# Altium project 20K Control Board V1.1.PrjPCB (part 2 of 6)

## Sheet DC SPS.SchDoc
size A2
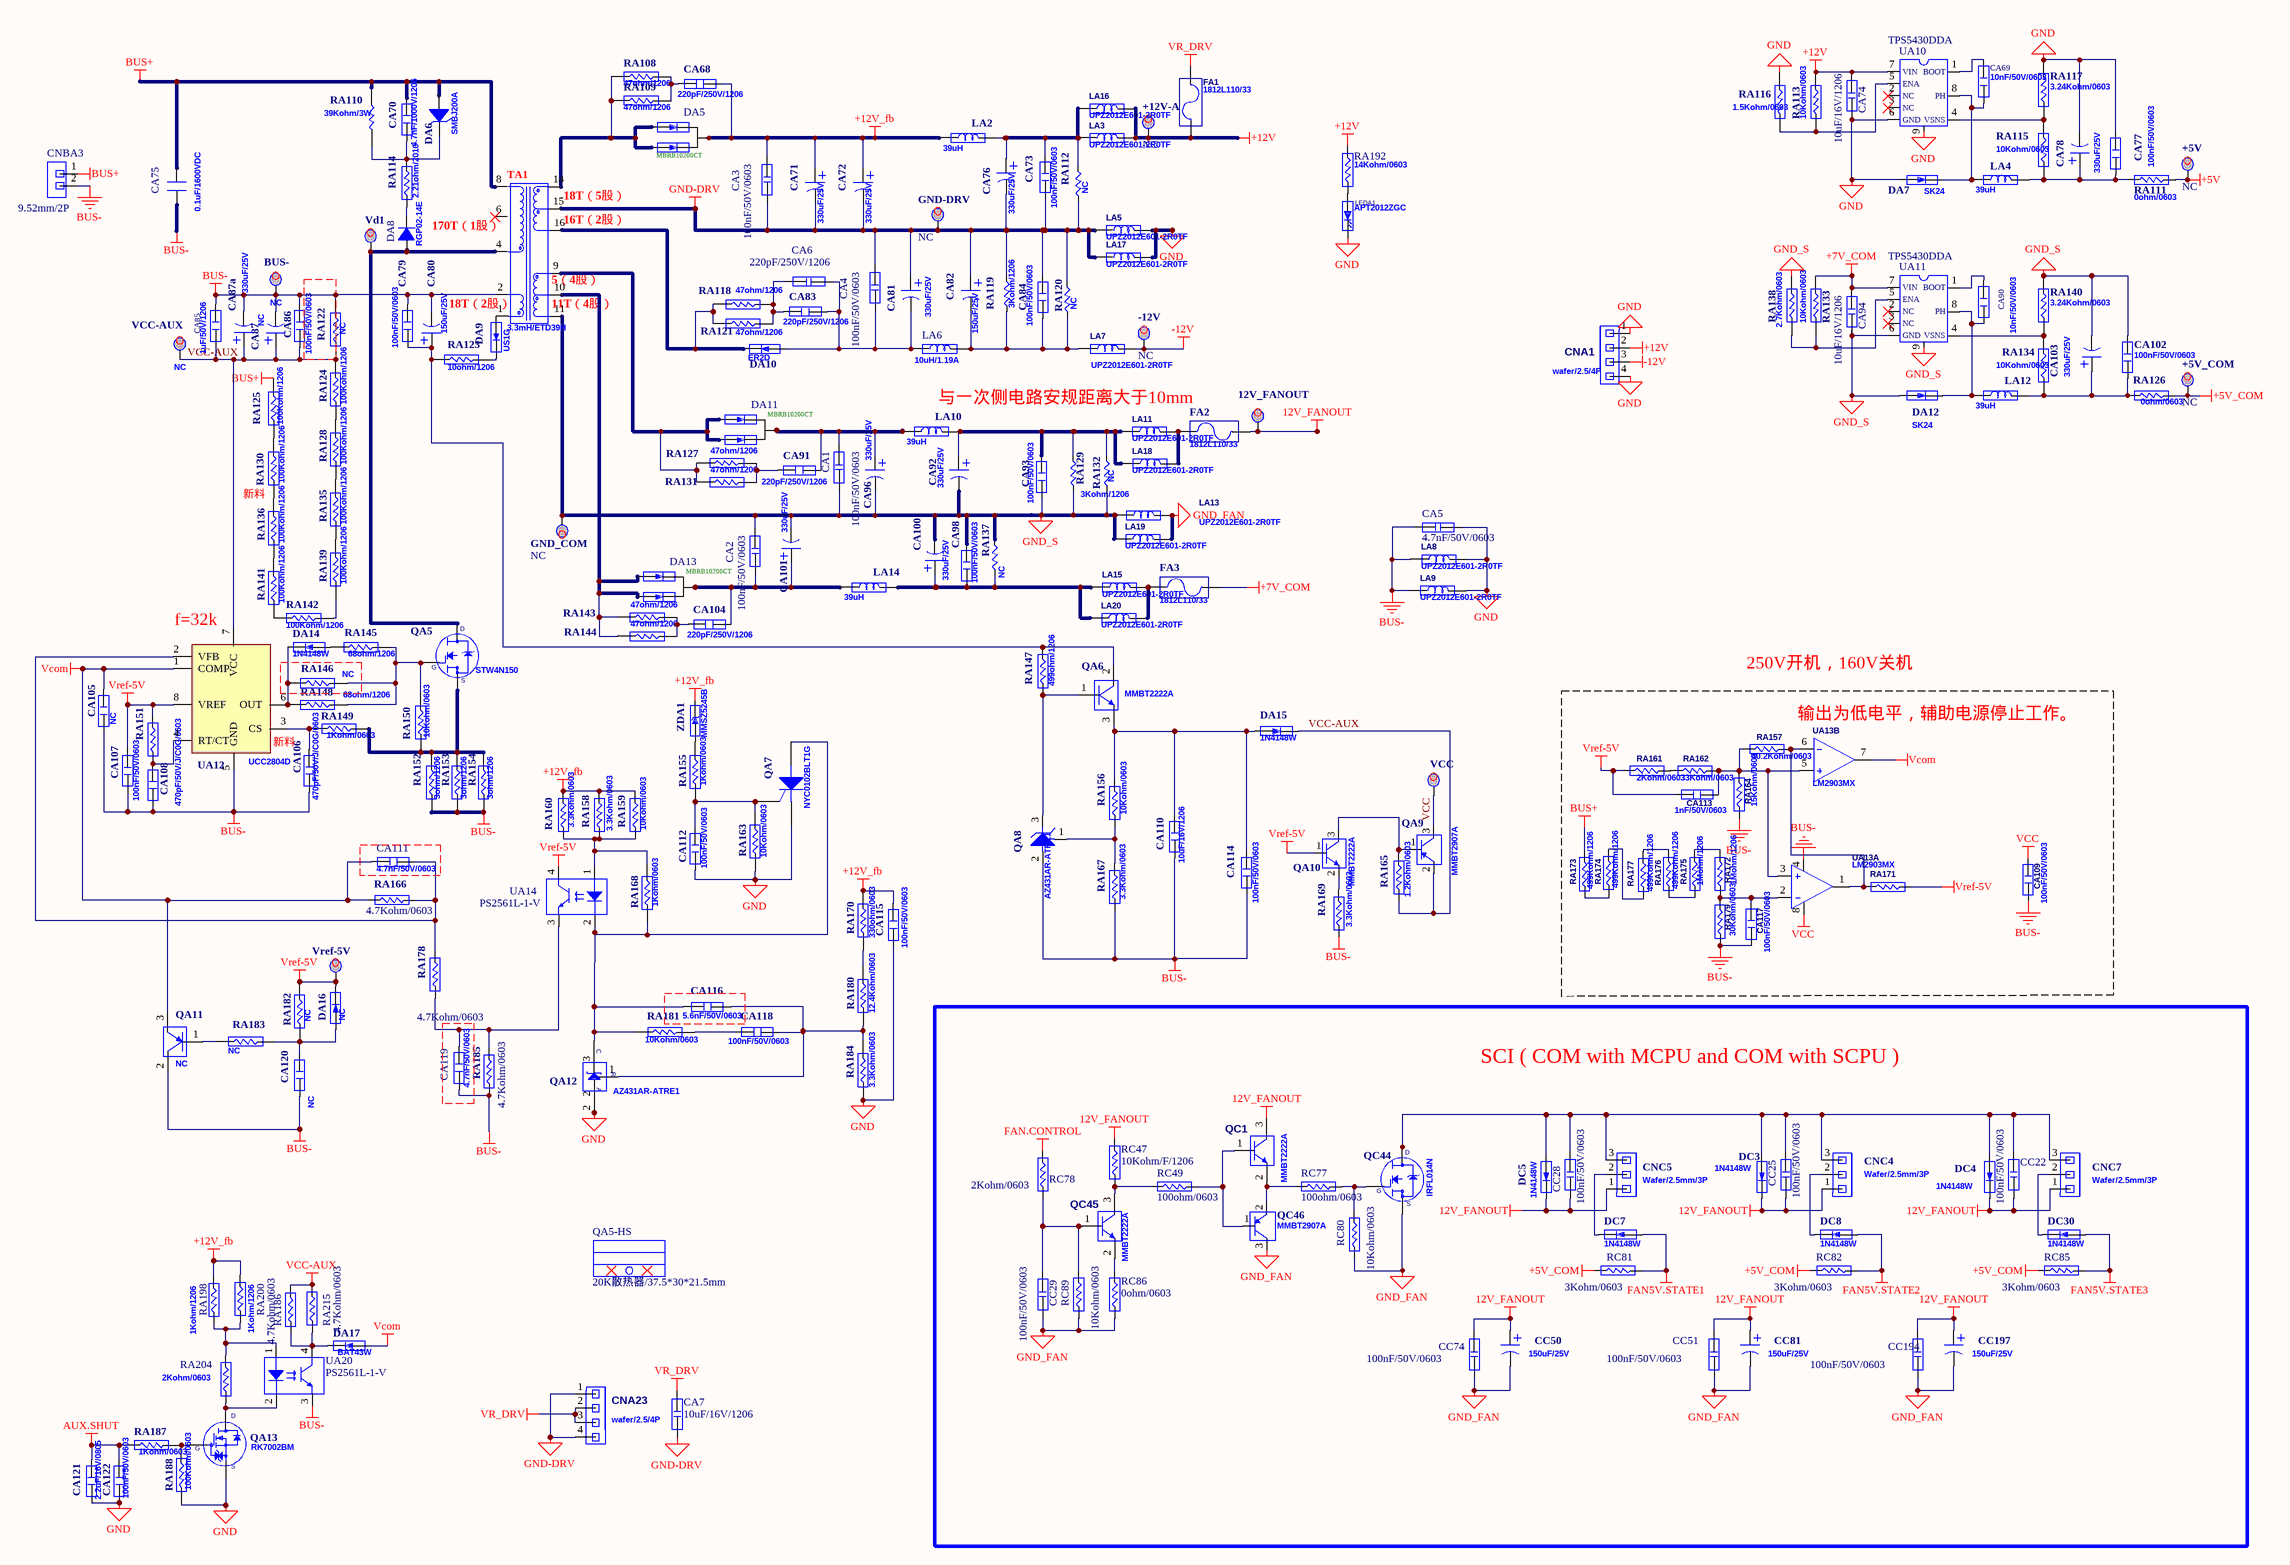
[diagram p2: DC SPS.SchDoc]

### Parts
12V_FANOUT  NC  [TEST-12]  (value not drawn)
+5V  NC  [TEST-12]
+5V_COM  NC  [TEST-12]
+12V-A  NC  [TEST-12]
-12V  NC  [TEST-12]
BUS-  NC  [TEST-12]
CA1  value 100nF/50V/0603  [C0603SM]  (hidden comment: 023-105220-0)
CA2  value 100nF/50V/0603  [C0603SM]  (hidden comment: 023-105220-0)
CA3  value 100nF/50V/0603  [C0603SM]  (hidden comment: 023-105220-0)
CA4  value 100nF/50V/0603  [C0603SM]  (hidden comment: 023-105220-0)
CA5  value 4.7nF/50V/0603  [C0603SM]  (hidden comment: 023-472220-0)
CA6  value 220pF/250V/1206  [C1206SM]  (hidden comment: 023-221250-0)
CA7  value 10uF/16V/1206  [C1206SM]  (hidden comment: 023-106350-0)
CA68  value 220pF/250V/1206  [CC3216-1206]  (hidden comment: 023-221250-0)
CA69  value 10nF/50V/0603  [CC1608-0603]  (hidden comment: 023-103220-0)
CA70  value 4.7nF/1000V/1206  [CC3216-1206]  (hidden comment: 023-472350-0)
CA71  value 330uF/25V  [EC3.5/8.5]  (hidden comment: 020-337100-0)
CA72  value 330uF/25V  [EC3.5/8.5]  (hidden comment: 020-337100-0)
CA73  value 100nF/50V/0603  [CC1608-0603]  (hidden comment: 023-105220-0)
CA74  value 10uF/16V/1206  [C1206SM]  (hidden comment: 023-106350-0)
CA75  value 0.1uF/1600VDC  [PC104/1600V-22.5]  (hidden comment: 022-104001-0)
CA76  value 330uF/25V  [EC3.5/8.5]  (hidden comment: 020-337100-0)
CA77  value 100nF/50V/0603  [CC1608-0603]  (hidden comment: 023-105220-0)
CA78  value 330uF/25V  [EC3.5/8.5]  (hidden comment: 020-337100-0)
CA79  value 100nF/50V/0603  [CC1608-0603]  (hidden comment: 023-105220-0)
CA80  value 150uF/25V  [EC2.54/6.3]  (hidden comment: 020-157111-0)
CA81  value 330uF/25V  [EC3.5/8.5]  (hidden comment: 020-337100-0)
CA82  value 150uF/25V  [EC2.54/6.3]  (hidden comment: 020-157111-0)
CA83  value 220pF/250V/1206  [CC3216-1206]  (hidden comment: 023-221250-0)
CA84  value 100nF/50V/0603  [CC1608-0603]  (hidden comment: 023-105220-0)
CA85  value 1uF/50V/1206  [CC3216-1206]  (hidden comment: 023-105250-0)
CA86  value 100nF/50V/0603  [CC1608-0603]  (hidden comment: 023-105220-0)
CA87  NC  [EC2.54/6.3]
CA87a  value 330uF/25V  [EC3.5/8.5]  (hidden comment: 020-337100-0)
CA90  value 10nF/50V/0603  [CC1608-0603]  (hidden comment: 023-103220-0)
CA91  value 220pF/250V/1206  [CC3216-1206]  (hidden comment: 023-221250-0)
CA92  value 330uF/25V  [EC3.5/8.5]  (hidden comment: 020-337100-0)
CA93  value 100nF/50V/0603  [CC1608-0603]  (hidden comment: 023-105220-0)
CA94  value 10uF/16V/1206  [C1206SM]  (hidden comment: 023-106350-0)
CA96  value 330uF/25V  [EC3.5/8.5]  (hidden comment: 020-337100-0)
CA98  value 100nF/50V/0603  [CC1608-0603]  (hidden comment: 023-105220-0)
CA100  value 330uF/25V  [EC3.5/8.5]  (hidden comment: 020-337100-0)
CA101  value 330uF/25V  [EC3.5/8.5]  (hidden comment: 020-337100-0)
CA102  value 100nF/50V/0603  [CC1608-0603]  (hidden comment: 023-105220-0)
CA103  value 330uF/25V  [EC3.5/8.5]  (hidden comment: 020-337100-0)
CA104  value 220pF/250V/1206  [CC3216-1206]  (hidden comment: 023-221250-0)
CA105  NC  [CC1608-0603]
CA106  value 470pF/50V/J/C0G/0603  [CC1608-0603]  (hidden comment: 023-471220-0)
CA107  value 100nF/50V/0603  [CC1608-0603]  (hidden comment: 023-105220-0)
CA108  value 470pF/50V/J/C0G/0603  [CC1608-0603]  (hidden comment: 023-471220-0)
CA109  value 100nF/50V/0603  [CC1608-0603]  (hidden comment: 023-105220-0)
CA110  value 10uF/16V/1206  [CC3216-1206]  (hidden comment: 023-106350-0)
CA111  value 4.7nF/50V/0603  [CC1608-0603]  (hidden comment: 023-472220-0)
CA112  value 100nF/50V/0603  [CC1608-0603]  (hidden comment: 023-105220-0)
CA113  value 1nF/50V/0603  [CC1608-0603]  (hidden comment: 023-102220-0)
CA114  value 100nF/50V/0603  [CC1608-0603]  (hidden comment: 023-105220-0)
CA115  value 100nF/50V/0603  [CC1608-0603]  (hidden comment: 023-105220-0)
CA116  value 5.6nF/50V/0603  [CC1608-0603]  (hidden comment: 023-562220-0)
CA117  value 100nF/50V/0603  [CC1608-0603]  (hidden comment: 023-105220-0)
CA118  value 100nF/50V/0603  [CC1608-0603]  (hidden comment: 023-105220-0)
CA119  value 4.7nF/50V/0603  [CC1608-0603]  (hidden comment: 023-472220-0)
CA120  NC  [CC1608-0603]
CA121  value 2.2uF/16V/0805  [CC2012-0805]  (hidden comment: 023-225330-0)
CA122  value 100nF/50V/0603  [CC1608-0603]  (hidden comment: 023-105220-0)
CC22  value 100nF/50V/0603  [C0603SM]  (hidden comment: 023-105220-0)
CC25  value 100nF/50V/0603  [C0603SM]  (hidden comment: 023-105220-0)
CC28  value 100nF/50V/0603  [C0603SM]  (hidden comment: 023-105220-0)
CC29  value 100nF/50V/0603  [C0603SM]  (hidden comment: 023-105220-0)
CC50  value 150uF/25V  [EC2.54/6.3]  (hidden comment: 020-157111-0)
CC51  value 100nF/50V/0603  [C0603SM]  (hidden comment: 023-105220-0)
CC74  value 100nF/50V/0603  [C0603SM]  (hidden comment: 023-105220-0)
CC81  value 150uF/25V  [EC2.54/6.3]  (hidden comment: 020-157111-0)
CC194  value 100nF/50V/0603  [C0603SM]  (hidden comment: 023-105220-0)
CC197  value 150uF/25V  [EC2.54/6.3]  (hidden comment: 020-157111-0)
CNA1  value wafer/2.5/4P  [CN2.5-4P]  (hidden comment: 110-252000-0)
CNA23  value wafer/2.5/4P  [CN2.5-4P]  (hidden comment: 110-252000-0)
CNBA3  value 9.52mm/2P  [CN2P9.52]  (hidden comment: 110-309501-0)
CNC4  value Wafer/2.5mm/3P  [CN2.5-3P]  (hidden comment: 110-251000-0)
CNC5  value Wafer/2.5mm/3P  [CN2.5-3P]  (hidden comment: 110-251000-0)
CNC7  value Wafer/2.5mm/3P  [CN2.5-3P]  (hidden comment: 110-251000-0)
DA5  value MBRB10200CT  [D2PAK - 1]  (hidden comment: 060-310030-0)
DA6  value SMBJ200A  [TVS-SMB]  (hidden comment: 083-100010-0)
DA7  value SK24  [DO-SMB]  (hidden comment: 060-310020-0)
DA8  value RGP02-14E  [DO-5.08/2.5]  (hidden comment: 060-100000-0)
DA9  value US1G  [DO-SMA]  (hidden comment: 060-110010-0)
DA10  value ER2D  [DO-SMA]  (hidden comment: 060-110000-0)
DA11  value MBRB10200CT  [D2PAK - 1]  (hidden comment: 060-310030-0)
DA12  value SK24  [DO-SMB]  (hidden comment: 060-310020-0)
DA13  value MBRB10200CT  [D2PAK - 1]  (hidden comment: 060-310030-0)
DA14  value 1N4148W  [SOD-123]  (hidden comment: 060-500010-0)
DA15  value 1N4148W  [SOD-123]  (hidden comment: 060-500010-0)
DA16  NC  [SOD-123]
DA17  value BAT43W  [SOD-123]  (hidden comment: 060-310000-0)
DC3  value 1N4148W  [SOD-123]  (hidden comment: 060-500010-0)
DC4  value 1N4148W  [SOD-123]  (hidden comment: 060-500010-0)
DC5  value 1N4148W  [SOD-123]  (hidden comment: 060-500010-0)
DC7  value 1N4148W  [SOD-123]  (hidden comment: 060-500010-0)
DC8  value 1N4148W  [SOD-123]  (hidden comment: 060-500010-0)
DC30  value 1N4148W  [SOD-123]  (hidden comment: 060-500010-0)
FA1  value 1812L110/33  [17KFUSE1812L110-33]  (hidden comment: 160-201000-0)
FA2  value 1812L110/33  [17KFUSE1812L110-33]  (hidden comment: 160-201000-0)
FA3  value 1812L110/33  [17KFUSE1812L110-33]  (hidden comment: 160-201000-0)
GND-DRV  NC  [TEST-12]
GND_COM  NC  [TEST-12]
LA2  value 39uH  [L1110SM- 39UH]  (hidden comment: 040-390000-0)
LA3  value UPZ2012E601-2R0TF  [L2012-0805]  (hidden comment: 080-200000-0)
LA4  value 39uH  [L1110SM- 39UH]  (hidden comment: 040-390000-0)
LA5  value UPZ2012E601-2R0TF  [L2012-0805]  (hidden comment: 080-200000-0)
LA6  value 10uH/1.19A  [L4848SM]  (hidden comment: 040-109100-0)
LA7  value UPZ2012E601-2R0TF  [L2012-0805]  (hidden comment: 080-200000-0)
LA8  value UPZ2012E601-2R0TF  [L2012-0805]  (hidden comment: 080-200000-0)
LA9  value UPZ2012E601-2R0TF  [L2012-0805]  (hidden comment: 080-200000-0)
LA10  value 39uH  [L1110SM- 39UH]  (hidden comment: 040-390000-0)
LA11  value UPZ2012E601-2R0TF  [L2012-0805]  (hidden comment: 080-200000-0)
LA12  value 39uH  [L1110SM- 39UH]  (hidden comment: 040-390000-0)
LA13  value UPZ2012E601-2R0TF  [L2012-0805]  (hidden comment: 080-200000-0)
LA14  value 39uH  [L1110SM- 39UH]  (hidden comment: 040-390000-0)
LA15  value UPZ2012E601-2R0TF  [L2012-0805]  (hidden comment: 080-200000-0)
LA16  value UPZ2012E601-2R0TF  [L2012-0805]  (hidden comment: 080-200000-0)
LA17  value UPZ2012E601-2R0TF  [L2012-0805]  (hidden comment: 080-200000-0)
LA18  value UPZ2012E601-2R0TF  [L2012-0805]  (hidden comment: 080-200000-0)
LA19  value UPZ2012E601-2R0TF  [L2012-0805]  (hidden comment: 080-200000-0)
LA20  value UPZ2012E601-2R0TF  [L2012-0805]  (hidden comment: 080-200000-0)
LEDA1  value APT2012ZGC  [LED2012-0805SM]  (hidden comment: 060-011000-0)
QA5  value STW4N150  [TO-247]  (hidden comment: 063-000010-0)
QA5-HS  value 20K散热器/37.5*30*21.5mm  [HS30x10x37.5]  (hidden comment: 431-100000-0)
QA6  value MMBT2222A  [SOT-23]  (hidden comment: 061-010000-0)
QA7  value NYC0102BLT1G  [SOT-23]  (hidden comment: 062-000010-0)
QA8  value AZ431AR-ATRE1  [SOT89N]  (hidden comment: 050-210020-0)
QA9  value MMBT2907A  [SOT-23]  (hidden comment: 061-110000-0)
QA10  value MMBT2222A  [SOT-23]  (hidden comment: 061-010000-0)
QA11  NC  [SOT-23]
QA12  value AZ431AR-ATRE1  [SOT89N]  (hidden comment: 050-210020-0)
QA13  value RK7002BM  [SOT-23 - 1]  (hidden comment: 063-010010-0)
QC1  value MMBT2222A  [SOT-23]  (hidden comment: 061-010000-0)
QC44  value IRFL014N  [SOT223]  (hidden comment: 063-010000-0)
QC45  value MMBT2222A  [SOT-23]  (hidden comment: 061-010000-0)
QC46  value MMBT2907A  [SOT-23]  (hidden comment: 061-110000-0)
RA108  value 47ohm/1206  [R3216-1206]  (hidden comment: 011-470050-0)
RA109  value 47ohm/1206  [R3216-1206]  (hidden comment: 011-470050-0)
RA110  value 39Kohm/3W  [R3WA-5.0-S]  (hidden comment: 013-390240-0)
RA111  value 0ohm/0603  [R1608-0603]  (hidden comment: 011-000020-0)
RA112  NC  [R3216-1206]
RA113  value 10Kohm/0603  [R1608-0603]  (hidden comment: 011-103020-0)
RA114  value 2.21ohm/2010  [R5025-2010]  (hidden comment: 011-227070-0)
RA115  value 10Kohm/0603  [R1608-0603]  (hidden comment: 011-103020-0)
RA116  value 1.5Kohm/0603  [R1608-0603]  (hidden comment: 011-152020-0)
RA117  value 3.24Kohm/0603  [R1608-0603]  (hidden comment: 011-322020-0)
RA118  value 47ohm/1206  [R3216-1206]  (hidden comment: 011-470050-0)
RA119  value 3Kohm/1206  [R3216-1206]  (hidden comment: 011-302050-0)
RA120  NC  [R3216-1206]
RA121  value 47ohm/1206  [R3216-1206]  (hidden comment: 011-470050-0)
RA122  NC  [R1608-0603]
RA123  value 10ohm/1206  [R3216-1206]  (hidden comment: 011-100050-0)
RA124  value 100Kohm/1206  [R3216-1206]  (hidden comment: 011-104050-0)
RA125  value 100Kohm/1206  [R3216-1206]  (hidden comment: 011-104050-0)
RA126  value 0ohm/0603  [R1608-0603]  (hidden comment: 011-000020-0)
RA127  value 47ohm/1206  [R3216-1206]  (hidden comment: 011-470050-0)
RA128  value 100Kohm/1206  [R3216-1206]  (hidden comment: 011-104050-0)
RA129  value 3Kohm/1206  [R3216-1206]  (hidden comment: 011-302050-0)
RA130  value 100Kohm/1206  [R3216-1206]  (hidden comment: 011-104050-0)
RA131  value 47ohm/1206  [R3216-1206]  (hidden comment: 011-470050-0)
RA132  NC  [R3216-1206]
RA133  value 10Kohm/0603  [R1608-0603]  (hidden comment: 011-103020-0)
RA134  value 10Kohm/0603  [R1608-0603]  (hidden comment: 011-103020-0)
RA135  value 100Kohm/1206  [R3216-1206]  (hidden comment: 011-104050-0)
RA136  value 100Kohm/1206  [R3216-1206]  (hidden comment: 011-104050-0)
RA137  NC  [R3216-1206]
RA138  value 2.7Kohm/0603  [R1608-0603]  (hidden comment: 011-272020-0)
RA139  value 100Kohm/1206  [R3216-1206]  (hidden comment: 011-104050-0)
RA140  value 3.24Kohm/0603  [R1608-0603]  (hidden comment: 011-322020-0)
RA141  value 100Kohm/1206  [R3216-1206]  (hidden comment: 011-104050-0)
RA142  value 100Kohm/1206  [R3216-1206]  (hidden comment: 011-104050-0)
RA143  value 47ohm/1206  [R3216-1206]  (hidden comment: 011-470050-0)
RA144  value 47ohm/1206  [R3216-1206]  (hidden comment: 011-470050-0)
RA145  value 68ohm/1206  [R3216-1206]  (hidden comment: 011-680050-0)
RA146  NC  [R3216-1206]
RA147  value 499ohm/1206  [R3216-1206]  (hidden comment: 011-491050-0)
RA148  value 68ohm/1206  [R3216-1206]  (hidden comment: 011-680050-0)
RA149  value 1Kohm/0603  [R1608-0603]  (hidden comment: 011-102020-0)
RA150  value 10Kohm/0603  [R1608-0603]  (hidden comment: 011-103020-0)
RA151  011-493020-0  [R1608-0603]  (value not drawn)
RA152  value 3ohm/1206  [R3216-1206]  (hidden comment: 011-307050-0)
RA153  value 3ohm/1206  [R3216-1206]  (hidden comment: 011-307050-0)
RA154  value 3ohm/1206  [R3216-1206]  (hidden comment: 011-307050-0)
RA155  value 1Kohm/0603  [R1608-0603]  (hidden comment: 011-102020-0)
RA156  value 10Kohm/0603  [R1608-0603]  (hidden comment: 011-103020-0)
RA157  value 40.2Kohm/0603  [R1608-0603]  (hidden comment: 011-403020-0)
RA158  value 3.3Kohm/0603  [R1608-0603]  (hidden comment: 011-332020-0)
RA159  value 10Kohm/0603  [R1608-0603]  (hidden comment: 011-103020-0)
RA160  value 3.3Kohm/0603  [R1608-0603]  (hidden comment: 011-332020-0)
RA161  value 2Kohm/0603  [R1608-0603]  (hidden comment: 011-202020-0)
RA162  value 33Kohm/0603  [R1608-0603]  (hidden comment: 011-333020-0)
RA163  value 10Kohm/0603  [R1608-0603]  (hidden comment: 011-103020-0)
RA164  value 15Kohm/0603  [R1608-0603]  (hidden comment: 011-153020-0)
RA165  value 1.2Kohm/0603  [R1608-0603]  (hidden comment: 011-122020-0)
RA166  value 4.7Kohm/0603  [R1608-0603]  (hidden comment: 011-472020-0)
RA167  value 3.3Kohm/0603  [R1608-0603]  (hidden comment: 011-332020-0)
RA168  value 1Kohm/0603  [R1608-0603]  (hidden comment: 011-102020-0)
RA169  value 3.3Kohm/0603  [R1608-0603]  (hidden comment: 011-332020-0)
RA170  value 330ohm/0603  [R1608-0603]  (hidden comment: 011-331020-0)
RA171  011-493020-0  [R1608-0603]  (value not drawn)
RA172  value 1Mohm/1206  [R3216-1206]  (hidden comment: 011-106050-0)
RA173  value 499Kohm/1206  [R3216-1206]  (hidden comment: 011-494050-0)
RA174  value 499Kohm/1206  [R3216-1206]  (hidden comment: 011-494050-0)
RA175  value 1Mohm/1206  [R3216-1206]  (hidden comment: 011-106050-0)
RA176  value 499Kohm/1206  [R3216-1206]  (hidden comment: 011-494050-0)
RA177  value 499Kohm/1206  [R3216-1206]  (hidden comment: 011-494050-0)
RA178  value 4.7Kohm/0603  [R1608-0603]  (hidden comment: 011-472020-0)
RA179  value 30Kohm/0603  [R1608-0603]  (hidden comment: 011-303020-0)
RA180  value 12.4Kohm/0603  [R1608-0603]  (hidden comment: 011-123020-0)
RA181  value 10Kohm/0603  [R1608-0603]  (hidden comment: 011-103020-0)
RA182  NC  [R1608-0603]
RA183  NC  [R1608-0603]
RA184  value 3.3Kohm/0603  [R1608-0603]  (hidden comment: 011-332020-0)
RA185  value 4.7Kohm/0603  [R1608-0603]  (hidden comment: 011-472020-0)
RA186  value 4.7Kohm/0603  [R1608-0603]  (hidden comment: 011-472020-0)
RA187  value 1Kohm/0603  [R1608-0603]  (hidden comment: 011-102020-0)
RA188  value 100Kohm/0603  [R1608-0603]  (hidden comment: 011-104020-0)
RA192  value 14Kohm/0603  [R1608-0603]  (hidden comment: 011-143020-0)
RA198  value 1Kohm/1206  [R3216-1206]  (hidden comment: 011-102050-0)
RA200  value 1Kohm/1206  [R3216-1206]  (hidden comment: 011-102050-0)
RA204  value 2Kohm/0603  [R1608-0603]  (hidden comment: 011-202020-0)
RA215  value 4.7Kohm/0603  [R1608-0603]  (hidden comment: 011-472020-0)
RC47  value 10Kohm/F/1206  [R1206SM]  (hidden comment: 011-103050-0)
RC49  value 100ohm/0603  [R0603SM]  (hidden comment: 011-101020-0)
RC77  value 100ohm/0603  [R0603SM]  (hidden comment: 011-101020-0)
RC78  value 2Kohm/0603  [R0603SM]  (hidden comment: 011-202020-0)
RC80  value 10Kohm/0603  [R0603SM]  (hidden comment: 011-103020-0)
RC81  value 3Kohm/0603  [R0603SM]  (hidden comment: 011-302020-0)
RC82  value 3Kohm/0603  [R0603SM]  (hidden comment: 011-302020-0)
RC85  value 3Kohm/0603  [R0603SM]  (hidden comment: 011-302020-0)
RC86  value 0ohm/0603  [R0603SM]  (hidden comment: 011-000020-0)
RC89  value 10Kohm/0603  [R0603SM]  (hidden comment: 011-103020-0)
TA1  value 3.3mH/ETD39H  [EC39(8+8P)-1]  (hidden comment: 030-001000-0)
UA10  value TPS5430DDA  [SO8-5X4-PD]  (hidden comment: 050-210030-0)
UA11  value TPS5430DDA  [SO8-5X4-PD]  (hidden comment: 050-210030-0)
UA12  value UCC2804D  [SO8]  (hidden comment: 050-410010-0)
UA13  value LM2903MX  [SO8]  (hidden comment: 050-610040-0)  (parts A,B of 2)
UA14  value PS2561L-1-V  [LTV816SB-V]  (hidden comment: 050-010000-0)
UA20  value PS2561L-1-V  [LTV816SB-V]  (hidden comment: 050-010000-0)
VCC  NC  [TEST-12]  (value not drawn)
VCC-AUX  NC  [TEST-12]
Vd1  NC  [TEST-12]  (value not drawn)
Vref-5V  NC  [TEST-12]  (value not drawn)
ZDA1  value MMSZ5245B  [SOD-123]  (hidden comment: 060-210010-0)

### Blocks framed on the sheet
输出为低电平，辅助电源停止工作。: CA109 CA113 CA117 RA157 RA161 RA162 RA164 RA171-RA177 RA179 UA13
SCI ( COM with MCPU and COM with SCPU ): CC22 CC25 CC28 CC29 CC50 CC51 CC74 CC81 CC194 CC197 CNC4 CNC5 CNC7 DC3-DC5 DC7 DC8 DC30 QC1 QC44-QC46 RC47 RC49 RC77 RC78 RC80-RC82 RC85 RC86 RC89

### Nets
12V_FANOUT: 12V_FANOUT.1 CC22.1 CC25.1 CC28.1 CC50.1 CC51.2 CC74.2 CC81.1 CC194.2 CC197.1 CNC4.1 CNC5.1 CNC7.1 DC3.2 DC4.2 DC5.2 FA2.1 QC1.3 RC47.2
+5V: +5V.1 RA111.1
+5V_COM: +5V_COM.1 RA126.1 RC81.1 RC82.1 RC85.1
+7V_COM: CA94.2 FA3.1 RA133.1 UA11.7(VIN)
+12V: +12V-A.1 CA74.2 CNA1.2 FA1.2 LA3.2 LA16.2 RA113.1 RA192.2 UA10.7(VIN)
+12V_fb: CA3.2 CA68.2 CA71.1 CA72.1 CA115.2 DA5.2 DA5.4 LA2.1 RA158.2 RA159.2 RA160.2 RA170.2 RA198.2 RA200.2 ZDA1.2
-12V: -12V.1 CNA1.3 LA7.2
AUX.SHUT: CA121.2 CA122.2 RA187.1
BUS+: CA70.2 CA75.2 CNBA3.1 DA6.1(A) RA110.2 RA125.1 RA173.2 TA1.8
BUS-: BUS-.1 CA5.1 CA75.1 CA79.2 CA80.2 CA85.2 CA86.2 CA87.2 CA87a.2 CA105.1 CA106.1 CA107.2 CA108.1 CA109.1 CA110.1 CA114.1 CA117.1 CA119.1 CA120.1 CNBA3.2 LA8.1 LA9.1 QA8.2(A) QA11.2 RA122.2 RA152.1 RA153.1 RA154.1 RA164.1 RA167.1 RA169.1 RA179.1 RA185.1 TA1.2 UA12.5(GND) UA13.4(-) UA20.3
FAN5V.STATE1: DC7.1 RC81.2
FAN5V.STATE2: DC8.1 RC82.2
FAN5V.STATE3: DC30.1 RC85.2
FAN.CONTROL: RC78.2
GND: CA5.2 CA74.1 CA77.1 CA78.2 CA112.1 CA115.1 CA121.1 CA122.1 CNA1.1 CNA1.4 DA7.1 LA5.2 LA8.2 LA9.2 LA17.2 LEDA1.2 QA7.1(K) QA12.2 QA13.1 RA116.2 RA117.1 RA163.1 RA184.1 RA188.1 UA10.6(GND) UA10.9(GND)
GND-DRV: CA3.1 CA4.2 CA7.1 CA71.2 CA72.2 CA73.1 CA76.2 CA81.1 CA82.1 CA84.2 CNA23.1 CNA23.4 GND-DRV.1 LA5.1 LA17.1 RA112.2 RA119.1 RA120.1 TA1.15
GND_FAN: CC29.1 CC50.2 CC51.1 CC74.1 CC81.2 CC194.1 CC197.2 LA13.2 LA19.2 QC44.3 QC46.3 RC80.1 RC86.1 RC89.1
GND_S: CA1.1 CA2.2 CA92.2 CA93.1 CA94.1 CA96.2 CA98.2 CA100.2 CA101.2 CA102.1 CA103.2 DA12.1 GND_COM.1 LA13.1 LA19.1 RA129.2 RA132.2 RA137.1 RA138.1 RA140.1 TA1.11 UA11.6(GND) UA11.9(GND)
VCC: CA109.2 QA9.3 UA13.8(+) VCC.1
VCC-AUX: CA85.1 CA86.1 CA87.1 CA87a.1 DA15.2 QA9.2 RA122.1 RA124.1 RA165.1 RA186.2 RA215.2 UA12.7(VCC) VCC-AUX.1
Vcom: CA105.2 CA111.2 DA17.1(A) QA11.3 RA166.1 UA12.1(COMP) UA13.7
VR_DRV: CA7.2 CNA23.2 CNA23.3 FA1.1
Vref-5V: CA107.1 CA113.1 DA16.2 QA10.1 RA151.1 RA161.2 RA171.2 RA182.2 UA12.8(VREF) UA14.4 Vref-5V.1
NetCA1_2: CA1.2 CA91.2 CA96.1 DA11.2 DA11.4 LA10.1
NetCA2_1: CA2.1 CA101.1 CA104.2 DA13.2 DA13.4 LA14.1
NetCA4_1: CA4.1 CA6.2 CA81.2 CA83.2 DA10.1 LA6.1
NetCA6_1: CA6.1 CA83.1 RA118.2 RA121.2
NetCA68_1: CA68.1 RA108.2 RA109.2
NetCA69_1: CA69.1 UA10.1(BOOT)
NetCA69_2: CA69.2 DA7.2 LA4.1 UA10.8(PH)
NetCA70_1: CA70.1 DA6.2(K) RA110.1 RA114.1
NetCA73_2: CA73.2 CA76.1 LA2.2 LA3.1 LA16.1 RA112.1
NetCA77_2: CA77.2 CA78.1 LA4.2 RA111.2 RA115.2
NetCA79_1: CA79.1 CA80.1 QA6.2 RA123.2 RA147.2
NetCA82_2: CA82.2 CA84.1 LA6.2 LA7.1 RA119.2 RA120.2
NetCA90_1: CA90.1 UA11.1(BOOT)
NetCA90_2: CA90.2 DA12.2 LA12.1 UA11.8(PH)
NetCA91_1: CA91.1 RA127.2 RA131.2
NetCA92_1: CA92.1 CA93.2 LA10.2 LA11.1 LA18.1 RA129.1 RA132.1
NetCA98_1: CA98.1 CA100.1 LA14.2 LA15.1 LA20.1 RA137.2
NetCA102_2: CA102.2 CA103.1 LA12.2 RA126.2 RA134.2
NetCA104_1: CA104.1 RA143.2 RA144.2
NetCA106_2: CA106.2 RA149.2 UA12.3(CS)
NetCA108_2: CA108.2 RA151.2 UA12.4(RT/CT)
NetCA110_2: CA110.2 CA114.2 DA15.1 QA6.3 RA156.2
NetCA111_1: CA111.1 RA166.2 RA178.2 UA12.2(VFB)
NetCA112_2: CA112.2 QA7.2(G) RA155.1 RA163.2
NetCA113_2: CA113.2 RA157.1 RA162.1 RA164.2 UA13.3 UA13.5
NetCA116_1: CA116.1 CA118.1 QA12.1 RA180.1 RA184.2
NetCA116_2: CA116.2 QA7.3(A) QA12.3 RA168.1 RA181.2 UA14.2
NetCA117_2: CA117.2 RA172.2 RA179.2 UA13.2
NetCA118_2: CA118.2 RA181.1
NetCA119_2: CA119.2 RA178.1 RA185.2 UA14.3
NetCA120_2: CA120.2 DA16.1 RA182.1 RA183.1
NetCC22_2: CC22.2 CC25.2 CC28.2 CNC4.3 CNC5.3 CNC7.3 DC3.1 DC4.1 DC5.1 QC44.2 QC44.4
NetCC29_2: CC29.2 QC45.1 RC78.1 RC89.2
NetCNC4_2: CNC4.2 DC8.2
NetCNC5_2: CNC5.2 DC7.2
NetCNC7_2: CNC7.2 DC30.2
NetDA5_1: DA5.1 DA5.3 RA108.1 RA109.1 TA1.14
NetDA8_1: DA8.1 QA5.2 TA1.4 Vd1.1
NetDA8_2: DA8.2 RA114.2
NetDA9_1: DA9.1(A) TA1.1
NetDA9_2: DA9.2(K) RA123.1
NetDA10_2: DA10.2 RA118.1 RA121.1 TA1.16
NetDA11_1: DA11.1 DA11.3 RA127.1 RA131.1 TA1.9
NetDA13_1: DA13.1 DA13.3 RA143.1 RA144.1 TA1.10
NetDA14_1: DA14.1 RA145.1
NetDA14_2: DA14.2 RA146.1 RA148.1 UA12.6(OUT)
NetDA17_2: DA17.2(K) RA186.1 RA215.1 UA20.4
NetFA2_2: FA2.2 LA11.2 LA18.2
NetFA3_2: FA3.2 LA15.2 LA20.2
NetLEDA1_1: LEDA1.1 RA192.1
NetQA5_1: QA5.1 RA145.2 RA146.2 RA148.2 RA150.1
NetQA5_3: QA5.3 RA149.1 RA150.2 RA152.2 RA153.2 RA154.2
NetQA6_1: QA6.1 QA8.3(K) RA147.1
NetQA8_1: QA8.1(R) RA156.1 RA167.2
NetQA9_1: QA9.1 QA10.3 RA165.2
NetQA10_2: QA10.2 RA169.2
NetQA11_1: QA11.1 RA183.2
NetQA13_2: QA13.2 RA187.2 RA188.2
NetQA13_3: QA13.3 RA204.1 UA20.2
NetQC1_1: QC1.1 QC46.1 RC49.2
NetQC1_2: QC1.2 QC46.2 RC77.1
NetQC44_1: QC44.1 RC77.2 RC80.2
NetQC45_2: QC45.2 RC86.2
NetQC45_3: QC45.3 RC47.1 RC49.1
NetRA113_2: RA113.2 RA116.1 UA10.5(ENA)
NetRA115_1: RA115.1 RA117.2 UA10.4(VSENSE)
NetRA124_2: RA124.2 RA128.1
NetRA125_2: RA125.2 RA130.1
NetRA128_2: RA128.2 RA135.1
NetRA130_2: RA130.2 RA136.1
NetRA133_2: RA133.2 RA138.2 UA11.5(ENA)
NetRA134_1: RA134.1 RA140.2 UA11.4(VSENSE)
NetRA135_2: RA135.2 RA139.1
NetRA136_2: RA136.2 RA141.1
NetRA139_2: RA139.2 RA142.2
NetRA141_2: RA141.2 RA142.1
NetRA155_2: RA155.2 ZDA1.1
NetRA157_2: RA157.2 RA171.1 UA13.1 UA13.6
NetRA158_1: RA158.1 RA159.1 RA160.1 RA168.2 UA14.1
NetRA161_1: RA161.1 RA162.2
NetRA170_1: RA170.1 RA180.2
NetRA172_1: RA172.1 RA175.2
NetRA173_1: RA173.1 RA174.1
NetRA174_2: RA174.2 RA177.1
NetRA175_1: RA175.1 RA176.1
NetRA176_2: RA176.2 RA177.2
NetRA198_1: RA198.1 RA200.1 RA204.2 UA20.1

Not connected (* = marked no-connect by the designer): QA5-HS 1* 2*; TA1 6*; UA10 2(NC)* 3(NC)*; UA11 2(NC)* 3(NC)*

### Notes on the sheet
- 170T（1股）
- (near TA1) 18T（5股）
- (near TA1) 16T（2股）
- 18T（2股）
- (near TA1) 5（4股）
- (near TA1) 11T（4股）
- (near LA10) 与一次侧电路安规距离大于10mm
- 新料
- (near UA12) f=32k
- 250V开机，160V关机
- (near UA12) 新料
- (in symbol 17KIRF740) D; G; S
- (in symbol 17KIRFL014NTRPBF) D; G; S
- (in symbol 050-210030-0 SO8-5X4-PD) VSNS
- (in symbol IC 431SM) C; R; A
- (in symbol MOS RK7002SM) D; G; S

### Library data of the parts
12V_FANOUT +5V +5V_COM +12V-A -12V BUS- GND-DRV GND_COM VCC VCC-AUX Vref-5V = 17K TPD: Type: 插件; Value: NC
  12V_FANOUT +5V_COM +12V-A -12V BUS- GND-DRV GND_COM VCC VCC-AUX Vref-5V: User Parameter 1: NC
CA1-CA4 CC22 CC25 CC28 CC29 CC51 CC74 CC194 = 023-104320-0 C0603SM: 100nF/50V/J/X7R/0603; Name of Material: 陶瓷电容; Vendor: 三星/YAGEO; Assembly type: 贴片; PN: 023-104320-0
CA5 = 023-472220-0 C0603SM: 4.7nF/50V/J/X7R/0603; Name of Material: 陶瓷电容; Vendor: 三星/YAGEO; Assembly type: 贴片; PN: 023-472220-0
CA6 = 023-221250-0 C1206SM: 220pF/250V/J/C0G/1206; Name of Material: 陶瓷电容; Vendor: 三星/YAGEO; Assembly type: 贴片; PN: 023-221250-0
CA7 CA74 CA94 = 023-106350-0 C1206SM: 10uF/16V/K/X7R/1206; Name of Material: 陶瓷电容; Vendor: 三星/YAGEO; Assembly type: 贴片; PN: 023-106350-0
CA68 CA83 CA91 CA104 = C1206 SM: 220pF/250V/J/C0G/1206
CA69 CA90 = CC0603-103SM_J: 10nF/50V/J/X7R/0603; Part Type: SMD
CA70 = 17KC472/1KV: 4.7nF/1000V/K/X7R/1206
CA71 CA72 CA76 CA78 CA81 CA87a CA92 CA96 CA100 CA101 CA103 = C220UF/25V: 330uF/25V/Φ8*15/4000H/EKY
CA73 CA77 CA79 CA84 CA86 CA93 CA98 CA102 CA107 CA112 CA114 CA115 CA118 CA122 = C0603 SM: 100nF/50V/J/X7R/0603
CA75 = PC0.1uF/1600V: 0.1uF/1600VDC/±10%/P22.5/12*22*26.5; Vendor: WIMA; Part Type: THD
CA80 CA82 CC50 CC81 CC197 = C100UF插件: 150uF/25V/P2.5/Φ6.3*11/6000H
CA85 = C1206 SM: 1uF/50V/K/X7R/1206
CA87 = C100UF插件: PN: 020-157110-0; Value: NC
CA105 = C0603 SM: value: NC
CA106 = C0603 SM: 470pF/50V/J/C0G/0603
CA108 = CC0603-471SM: 470pF/50V/J/C0G/0603; Part Type: SMD
CA109 CA117 = CC0603-104SM_J: 100nF/50V/J/X7R/0603; Part Type: SMD
CA110 = CC1206-106/16VSM: 10uF/16V/K/X7R/1206; Part Type: SMD
CA111 CA119 = CC0603-103SM: 4.7nF/50V/J/X7R/0603; Part Type: SMD
CA113 = CC0603-102SM: 1nF/50V/J/C0G/0603; Part Type: SMD
CA116 = C0603 SM: 5.6nF/50V/K/0603
CA120 = C0603 SM: PN: 023-104320-0; value: NC
CA121 = CC0805-225/16VSM: 2.2uF/16V/K/X7R/0805; Part Type: SMD
CNA1 CNA23 = CN 25P04: Wafer/2.5 pitch/4 pin/182度/白胶/带卡勾; Part Type: THD
CNBA3 = 110-309500-0 CN2P9.52: 接线端子台/9.52mm/2P; Name of Material: 接线端子; Factory model: EK950V-02P; Assembly type: 贴片; PN: 110-309501-0
CNC4 CNC5 CNC7 = CN 25P03: Wafer/2.5 pitch/3 pin/181度/白胶/带卡勾
DA5 DA11 DA13 = D MBRB10200CT: 10A/200V/D(2)PAK; Vendor: MCC; Part Type: SMD
DA6 = 17KP6SMBJ170: 200V/600W/DO-214AA; Type: 贴片
DA7 DA12 = D SK24: 2A/40V/DO-214AA
DA8 = D RGP02-14E: 0.5A/1400V/DO-41; Vendor: MICROSEMI; Part Type: THD
DA9 = 17KUS1G: 1A/400V/DO-214AC; Type: 贴片
DA10 = D MURA220T3: 2A/200V/SMB
DA14 DA15 DC3-DC5 DC7 DC8 DC30 = D 1N4148W: 0.15A/75V/SOD-123
  DC3-DC5 DC7 DC8 DC30: Type: 插件
DA16 = D 1N4148W: Value: NC
DA17 = D S123SM: 0.2A/30V/SOD-123; Type: 贴片
FA1 = FS 1812L110-33MR: 1812L Series/1.1A/33V; Vendor: Littelfuse; Part Type: SMD
FA2 FA3 = 17KFUSE1812L110-33: 1812L Series/1.1A/33V
LA2 LA4 LA10 LA12 LA14 = L10090SM: 39uH/DR10*5.4RB K38/RI10*3.4*8.2 K38
LA3 LA5 LA7-LA9 LA11 LA13 LA15-LA20 = L-UPZ2012E601-2R0TF: 600ohm/2A/100MHz/0805; Vendor: Sunlord; Part Type: SMD
LA6 = L7444043100SM: 10uH/1.19A/±30%/4.8*4.8*2.8mm; Type: 贴片
LEDA1 = D LED0805_Green: 2.0*1.25*0.75mm/Green; Vendor: Everlight; Part Type: SMD
QA5 = 17KIRF740: 4A/1500V/TO-247
QA5-HS = 431-100000-0 HS30x10x37.5: 20K散热器/37.5*30*21.5mm; Name of Material: 散热器; Vendor: HUA TAI; Assembly type: 插件; PN: 431-100000-0
QA6 = TR 2SC4672SM: 0.6A/40VDC/SOT-23; Part Type: SMD
QA7 = SCR: 0.25A/200V/SOT-23
QA8 = IC TL431SM: Shunt Regulators/SOT-89; Vendor: TI; Part Type: SMD
QA9 QC46 = TR 2907SM: 0.6A/60VDC/SOT-23; Part Type: SMD
QA10 QC1 QC45 = TR 2222SM: 0.6A/40VDC/SOT-23
  QA10: Part Type: SMD
QA11 = TR 2SA1213SM: Vendor: TOSHIBA; PN: 061-110000-0; Part Type: SMD; Value: NC
QA12 = IC 431SM: Shunt Regulators/SOT-89; Type: 贴片
QA13 = MOS RK7002SM: 250mA/60V/SOT-23; Vendor: ROHM
QC44 = 17KIRFL014NTRPBF: 1.9A/55V/SOT-223; Type: 贴片
RA108 RA109 RA118 RA121 RA127 RA131 RA143 RA144 = R1206SM: 47ohm/1/4W/F/1206
RA110 = RSS 3W 39K: 39Kohm/3W/J/15.5*5; Type: 插件
RA111 RA126 = R0603SM-3K3: 0ohm/1/10W/F/0603; Part Type: SMD
RA112 RA120 RA132 RA137 = R3W-7K5: Part Type: THD; Value: NC
RA113 RA115 RA133 RA134 RA150 RA163 RA181 = R0603SM: 10Kohm/1/10W/F/0603
RA114 = R2010SM-221R: 2.21ohm/1/2W/F/2010; Part Type: SMD
RA116 = R0603SM: 1.5Kohm/1/10W/F/0603
RA117 RA140 = R0603SM: 3.24Kohm/1/10W/F/0603
RA119 RA129 = R3W-7K5: 3Kohm/1/4W/F/1206; Part Type: THD
RA122 = R0603SM: PN: 011-623020-0; Value: NC
RA123 = R1206SM: 10ohm/1/4W/F/1206
RA124 RA125 RA128 RA130 RA135 RA136 RA139 RA141 RA142 = R1206SM: 100Kohm/1/4W/F/1206
RA138 = R0603SM: 2.7Kohm/1/10W/F/0603
RA145 RA148 = R1206SM: 68ohm/1/4W/F/1206
RA146 = R1206SM: PN: 011-680050-0; value: NC
RA147 = R1206SM-499R: 499ohm/1/4W/F/1206; Part Type: SMD
RA149 RA155 RA168 RA187 = R0603SM: 1Kohm/1/10W/F/0603
RA151 RA171 = R0603SM-49K9: 49.9Kohm/1/10W/F/0603; Value: 49.9Kohm/0603; Part Type: SMD
RA152-RA154 = R1206SM: 3ohm/1/4W/F/1206
RA156 = R0603SM-10K: 10Kohm/1/10W/F/0603; Part Type: SMD
RA157 = R0603SM-100K: 40.2Kohm/1/10W/F/0603; Part Type: SMD
RA158 RA160 RA167 RA169 = R0603SM-3K3: 3.3Kohm/1/10W/F/0603; Part Type: SMD
RA159 = R0603SM-3K3: 10Kohm/1/10W/F/0603; Part Type: SMD
RA161 = R0603SM-30K: 2Kohm/1/10W/F/0603; Part Type: SMD
RA162 = R0603SM-30K: 33Kohm/1/10W/F/0603; Part Type: SMD
RA164 = R0603SM-15K: 15Kohm/1/10W/F/0603; Part Type: SMD
RA165 = R0603SM-1K2: 1.2Kohm/1/10W/F/0603; Part Type: SMD
RA166 RA178 RA185 = R0603SM-4K7: 4.7Kohm/1/10W/F/0603; Part Type: SMD
RA170 = R0603SM: 330ohm/1/10W/F/0603
RA172 RA175 = R1206SM-1M: 1Mohm/1/4W/F/1206; Part Type: SMD
RA173 RA174 RA176 RA177 = R1206SM-1M: 499Kohm/1/4W/F/1206; Part Type: SMD
RA179 = R0603SM-30K: 30Kohm/1/10W/F/0603
RA180 = R0603SM: 12.4Kohm/1/10W/F/0603
RA182 = R0603SM: PN: 011-204020-0; Value: NC
RA183 = R0603SM: PN: 011-100020-0; Value: NC
RA184 = R0603SM: 3.3Kohm/1/10W/F/0603
RA186 RA215 = R0603SM-2K: 4.7Kohm/1/10W/F/0603; Part Type: SMD
RA188 = R0603SM: 100Kohm/1/10W/F/0603
RA192 = R0603SM-14K: 14Kohm/1/10W/F/0603; Part Type: SMD
RA198 RA200 = R1206SM-100R: 1Kohm/1/4W/F/1206; Part Type: SMD
RA204 = R0603SM-2K: 2Kohm/1/10W/F/0603; Part Type: SMD
RC47 = 011-103050-0 R1206SM: 10Kohm/1/4W/F/1206; Name of Material: 厚膜电阻; Vendor: RALEC/YAGEO; Factory model: RTT06 10KF TP/RC1206FR-0710KL/1206W4F1002T5E; Assembly type: 贴片; PN: 011-103050-0
RC49 RC77 = 011-101020-0 R0603SM: 100ohm/1/10W/F/0603; Name of Material: 厚膜电阻; Vendor: RALEC/YAGEO; Factory model: RTT03 100RF TP/RC0603FR-07100RL; Assembly type: 贴片; PN: 011-101020-0
RC78 = 011-202020-0 R0603SM: 2Kohm/1/10W/F/0603; Name of Material: 厚膜电阻; Vendor: RALEC/YAGEO; Factory model: RTT03 2KF TP/RC0603FR-072KL; Assembly type: 贴片; PN: 011-202020-0
RC80 RC89 = 011-103020-0 R0603SM: 10Kohm/1/10W/F/0603; Name of Material: 厚膜电阻; Vendor: RALEC/YAGEO; Factory model: RTT03 10KF TP/RC0603FR-0710KL; Assembly type: 贴片; PN: 011-103020-0
RC81 RC82 RC85 = 011-302020-0 R0603SM: 3Kohm/1/10W/F/0603; Name of Material: 厚膜电阻; Vendor: RALEC/YAGEO; Factory model: RTT03 3KF TP/RC0603FR-073KL; Assembly type: 贴片; PN: 011-302020-0
RC86 = 011-000020-0 R0603SM: 0ohm/1/10W/F/0603; Name of Material: 厚膜电阻; Vendor: RALEC/YAGEO; Factory model: RTT03 0RF TP/RC0603FR-070RL; Assembly type: 贴片; PN: 011-000020-0
TA1 = ETD29 -1: 3.3mH/ETD39H/PC40/卧式/KB1892-20156; Type: 插件
UA10 UA11 = 050-210030-0 SO8-5X4-PD: Converter/SO-8; Name of Material: 集成电路; Vendor: TI; Assembly type: 贴片; PN: 050-210030-0; Factory model: TPS5430DDA
UA12 = 17KUC2845D8: Current-Mode PWM/SOIC-8; Type: 贴片
UA13 = IC LM2903IM-SM: Voltage Dual Comparator/SOIC-8; Vendor: FAIRCHILD; Part Type: SMD
UA14 UA20 = 050-011000-0 LTV816SB-V: Optocoupler/SO-4; Name of Material: 光耦; Vendor: LITEON; Assembly type: 贴片; PN: 050-010000-0
  UA14: Factory model: LTV816SB-V
  UA20: Factory model: PS2561L-1-V
Vd1 = 17K TPD: Type: 插件; User Parameter 1: NC; Value: NC
ZDA1 = DZ MMSZ18VSM: 0.5W/15V/SOD-123; Vendor: ON SEMI; Part Type: SMD